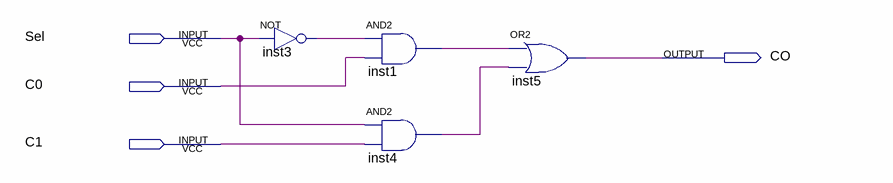
[diagram p0: schematic sheet]
// Quartus schematic Block7.bdf as structural Verilog: 4 symbols, 4 pins
module Block7 (
  input  Sel,
  input  C0,
  input  C1,
  output CO
);

  wire inst1_out, inst3_out, inst4_out;

  not inst3 (inst3_out, Sel);
  and inst1 (inst1_out, inst3_out, C0);
  and inst4 (inst4_out, Sel, C1);
  or inst5 (CO, inst1_out, inst4_out);
endmodule
